# Altium project ALCT_MEZ_SPARTAN6.PrjPcb (part 2 of 5)

## Sheet Configuration_Logic.SchDoc: Configuration Logic
size A2; Organization: UCLA High Energy Physics; DocumentNumber: 4; Revision: 2.0; SheetNumber: 4; SheetTotal: 12; CurrentDate: 8/7/2018; ModifiedDate: 8/20/2018
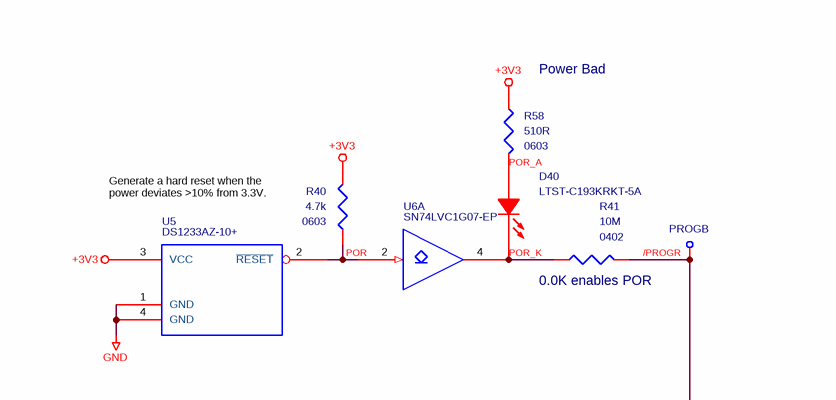
[diagram p5: Configuration_Logic.SchDoc, top left]
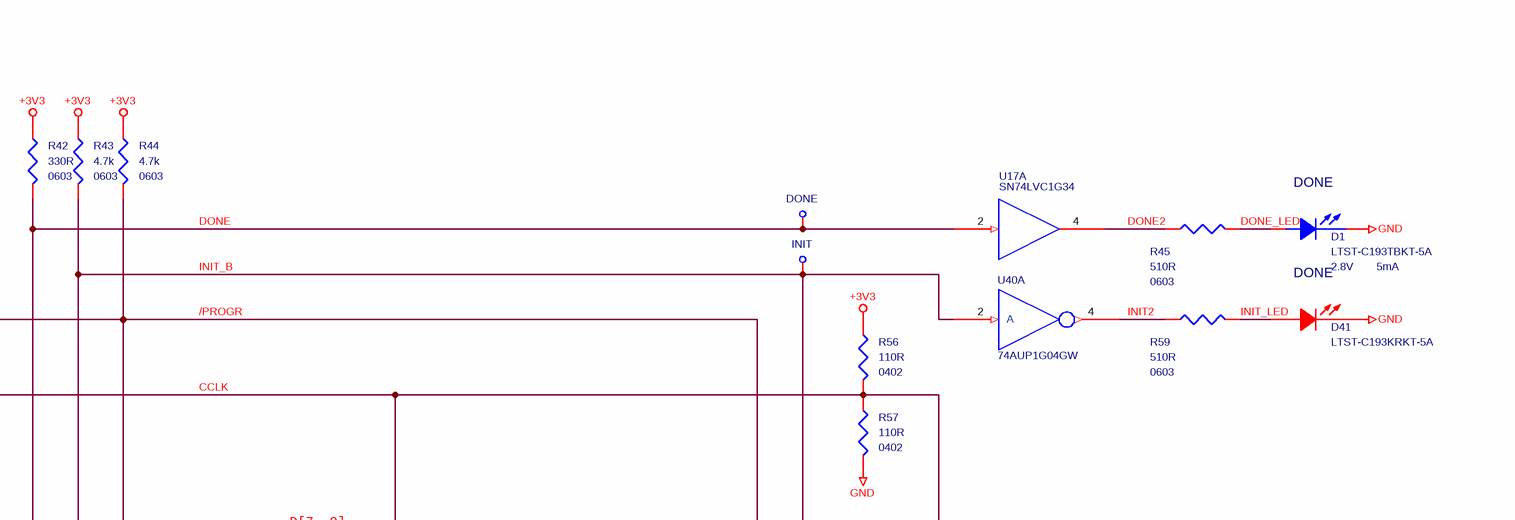
[diagram p6: Configuration_Logic.SchDoc, top right]
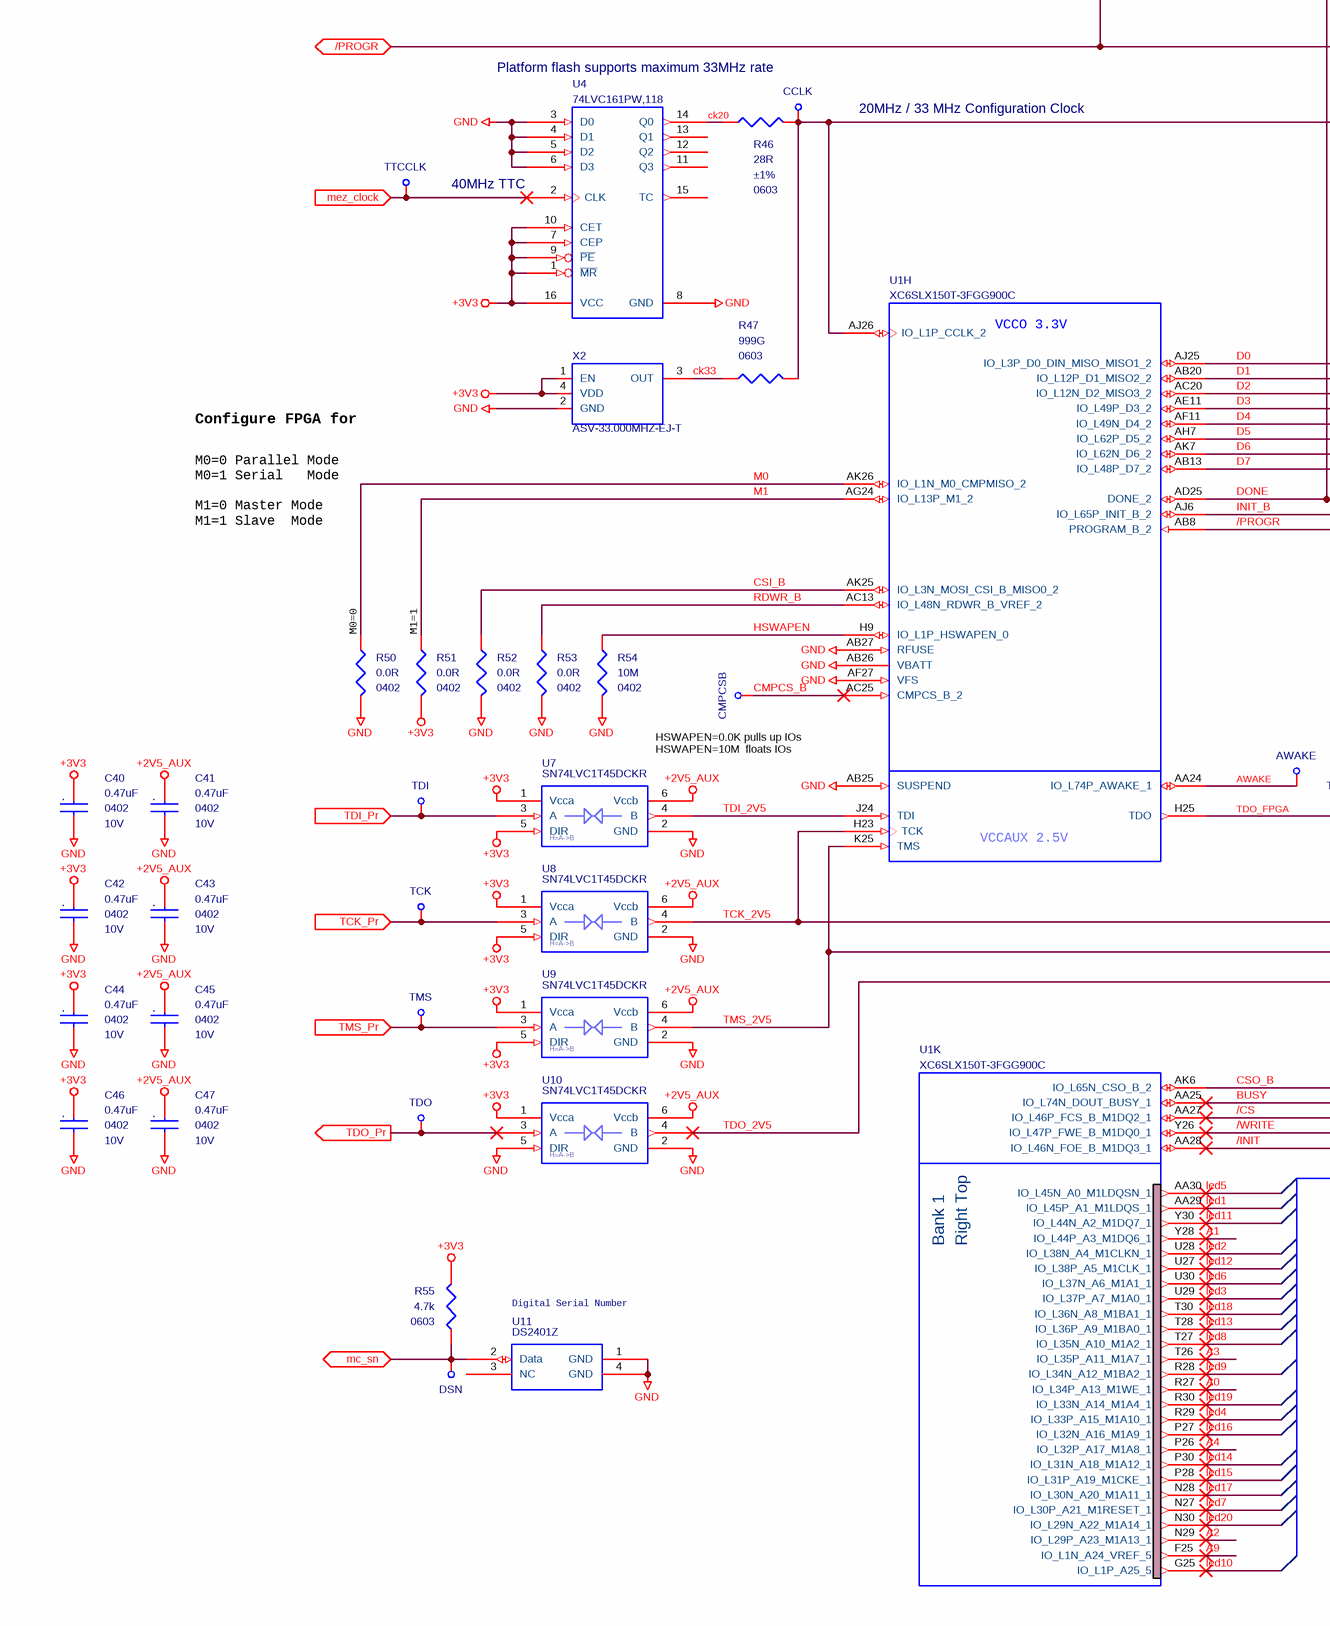
[diagram p7: Configuration_Logic.SchDoc, bottom left]
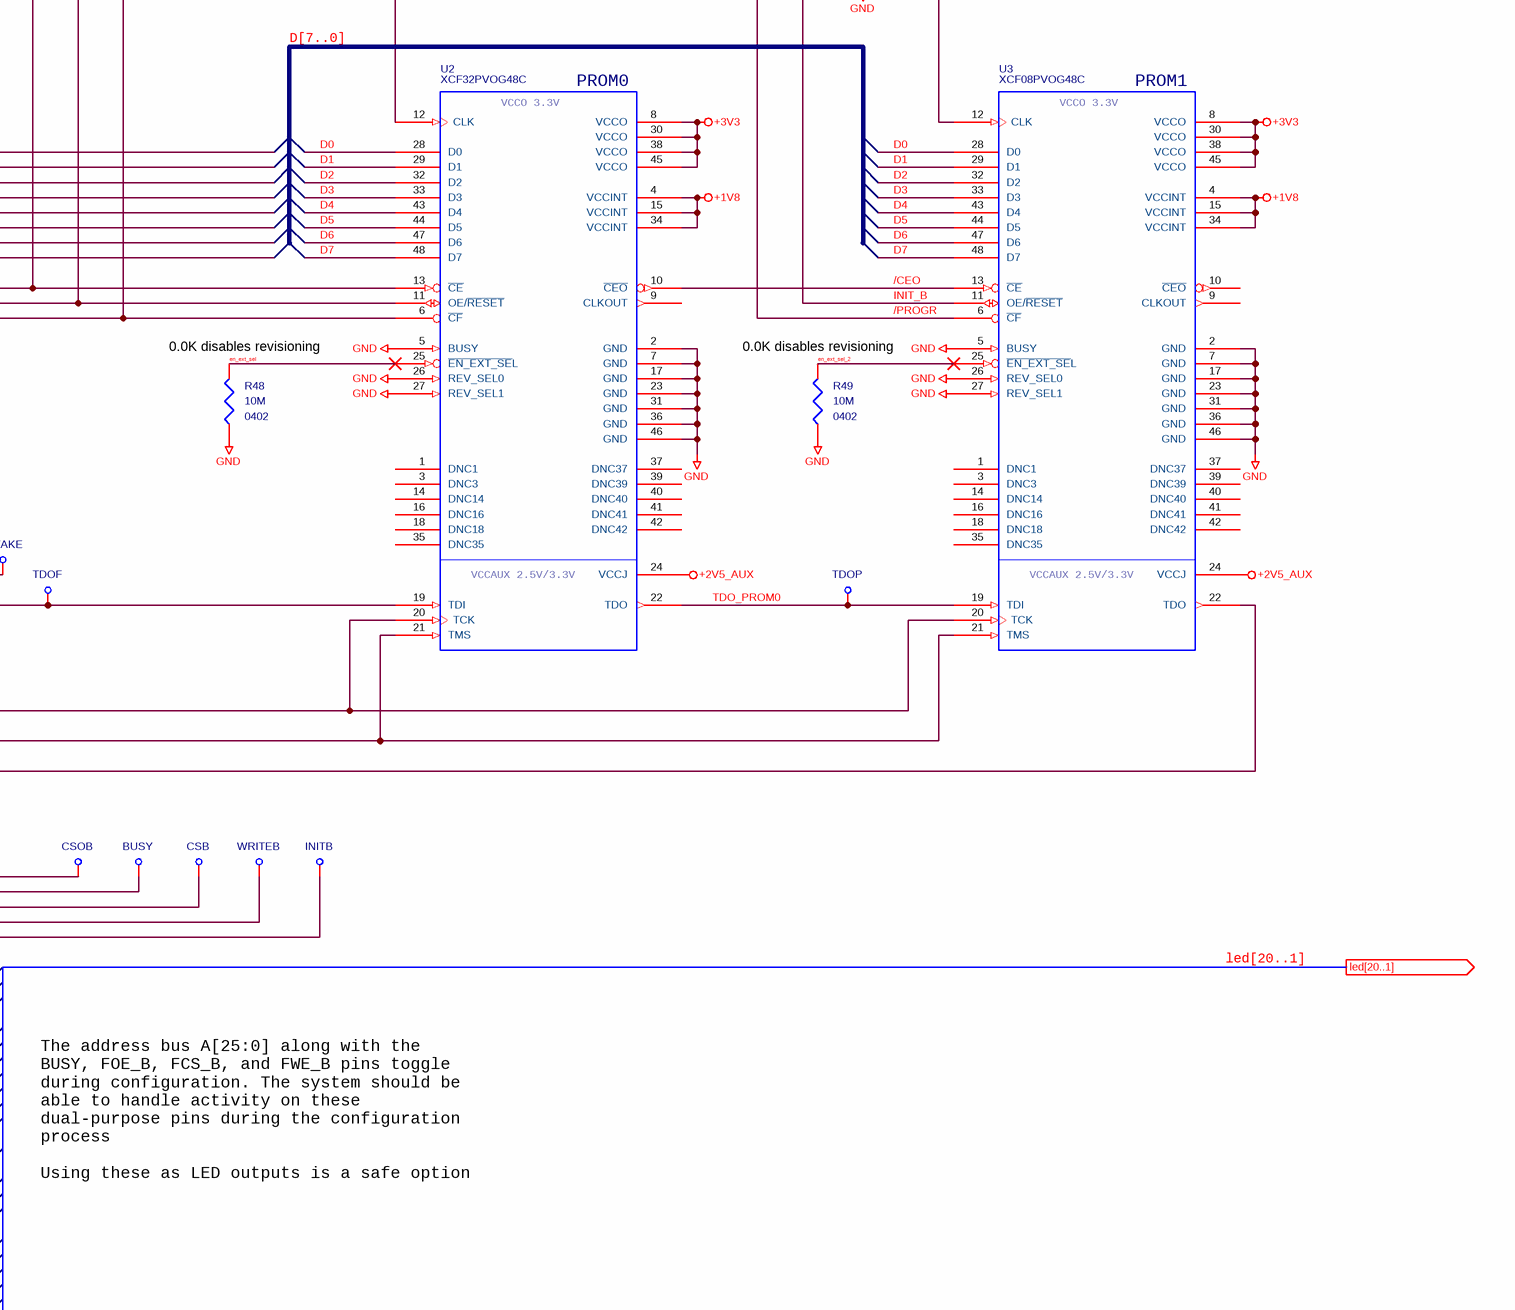
[diagram p8: Configuration_Logic.SchDoc, bottom right]

### Parts
AWAKE  Test Point Via  [MC_S6/TH/TPVIA]  (value not drawn)  (no BOM)
BUSY  Test Point Via  [MC_S6/TH/TPVIA]  (value not drawn)  (no BOM)
C40  0.47uF  Voltage - Rated: 10V  package: 0402  [MC_S6/SM/C_0402_IPC]
C41  0.47uF  Voltage - Rated: 10V  package: 0402  [MC_S6/SM/C_0402_IPC]
C42  0.47uF  Voltage - Rated: 10V  package: 0402  [MC_S6/SM/C_0402_IPC]
C43  0.47uF  Voltage - Rated: 10V  package: 0402  [MC_S6/SM/C_0402_IPC]
C44  0.47uF  Voltage - Rated: 10V  package: 0402  [MC_S6/SM/C_0402_IPC]
C45  0.47uF  Voltage - Rated: 10V  package: 0402  [MC_S6/SM/C_0402_IPC]
C46  0.47uF  Voltage - Rated: 10V  package: 0402  [MC_S6/SM/C_0402_IPC]
C47  0.47uF  Voltage - Rated: 10V  package: 0402  [MC_S6/SM/C_0402_IPC]
CCLK  Test Point Via  [MC_S6/TH/TPVIA]  (value not drawn)  (no BOM)
CMPCSB  Test Point Via  [MC_S6/TH/TPVIA]  (value not drawn)  (no BOM)
CSB  Test Point Via  [MC_S6/TH/TPVIA]  (value not drawn)  (no BOM)
CSOB  Test Point Via  [MC_S6/TH/TPVIA]  (value not drawn)  (no BOM)
D1  LTST-C193TBKT-5A  Voltage - Forward (Vf) (Typ): 2.8V  Current - Test: 5mA  [MC_S6/SM/LED_0603]
D40  LTST-C193KRKT-5A  [MC_S6/SM/LED_0603]
D41  LTST-C193KRKT-5A  [MC_S6/SM/LED_0603]
DONE  Test Point Via  [MC_S6/TH/TPVIA]  (value not drawn)  (no BOM)
DSN  Test Point Via  [MC_S6/TH/TPVIA]  (value not drawn)  (no BOM)
INIT  Test Point Via  [MC_S6/TH/TPVIA]  (value not drawn)  (no BOM)
INITB  Test Point Via  [MC_S6/TH/TPVIA]  (value not drawn)  (no BOM)
PROGB  Test Point Via  [MC_S6/TH/TPVIA]  (value not drawn)  (no BOM)
R40  4.7k  Supplier Device Package: 0603  [MC_S6/SM/R_0603_IPC]
R41  10M  Supplier Device Package: 0402  [MC_S6/SM/C_0402_IPC]
R42  330R  Supplier Device Package: 0603  [MC_S6/SM/R_0603_IPC]
R43  4.7k  Supplier Device Package: 0603  [MC_S6/SM/R_0603_IPC]
R44  4.7k  Supplier Device Package: 0603  [MC_S6/SM/R_0603_IPC]
R45  510R  Supplier Device Package: 0603  [MC_S6/SM/R_0603_IPC]
R46  28R  Tolerance: ±1%  Supplier Device Package: 0603  [MC_S6/SM/R_0603_IPC]
R47  999G  Supplier Device Package: 0603  [MC_S6/SM/R_0603_IPC]  (no BOM)
R48  10M  Supplier Device Package: 0402  [MC_S6/SM/C_0402_IPC]
R49  10M  Supplier Device Package: 0402  [MC_S6/SM/C_0402_IPC]
R50  0.0R  Supplier Device Package: 0402  [MC_S6/SM/R_0402_IPC]
R51  0.0R  Supplier Device Package: 0402  [MC_S6/SM/R_0402_IPC]
R52  0.0R  Supplier Device Package: 0402  [MC_S6/SM/R_0402_IPC]
R53  0.0R  Supplier Device Package: 0402  [MC_S6/SM/R_0402_IPC]
R54  10M  Supplier Device Package: 0402  [MC_S6/SM/C_0402_IPC]
R55  4.7k  Supplier Device Package: 0603  [MC_S6/SM/R_0603_IPC]
R56  110R  Supplier Device Package: 0402  [MC_S6/SM/R_0402_IPC]
R57  110R  Supplier Device Package: 0402  [MC_S6/SM/R_0402_IPC]
R58  510R  Supplier Device Package: 0603  [MC_S6/SM/R_0603_IPC]
R59  510R  Supplier Device Package: 0603  [MC_S6/SM/R_0603_IPC]
TCK  Test Point Via  [MC_S6/TH/TPVIA]  (value not drawn)  (no BOM)
TDI  Test Point Via  [MC_S6/TH/TPVIA]  (value not drawn)  (no BOM)
TDO  Test Point Via  [MC_S6/TH/TPVIA]  (value not drawn)  (no BOM)
TDOF  Test Point Via  [MC_S6/TH/TPVIA]  (value not drawn)  (no BOM)
TDOP  Test Point Via  [MC_S6/TH/TPVIA]  (value not drawn)  (no BOM)
TMS  Test Point Via  [MC_S6/TH/TPVIA]  (value not drawn)  (no BOM)
TTCCLK  Test Point Via  [MC_S6/TH/TPVIA]  (value not drawn)  (no BOM)
U1  XC6SLX150T-3FGG900C  [MC_S6/BGA/FGG900]  (parts H,K of 13)
U2  XCF32PVOG48C  [MC_S6/SM/VOG48]
U3  XCF08PVOG48C  [MC_S6/SM/VOG48]
U4  74LVC161PW,118  [MC_S6/SM/TSSOP16]
U5  DS1233AZ-10+  [MC_S6/SM/SOT223_1243]
U6  SN74LVC1G07-EP  [SOT353-1]  (part A of 2)
U7  SN74LVC1T45DCKR  [MC_S6/SM/SOT_SC70_DCK6]
U8  SN74LVC1T45DCKR  [MC_S6/SM/SOT_SC70_DCK6]
U9  SN74LVC1T45DCKR  [MC_S6/SM/SOT_SC70_DCK6]
U10  SN74LVC1T45DCKR  [MC_S6/SM/SOT_SC70_DCK6]
U11  DS2401Z  [MC_S6/SM/SOT223_1243]
U17  SN74LVC1G34  [MC_S6/SM/SOT_553_DRL5]  (part A of 2)
U40  74AUP1G04GW  [SOT353-1]  (part A of 2)
WRITEB  Test Point Via  [MC_S6/TH/TPVIA]  (value not drawn)  (no BOM)
X2  ASV-33.000MHZ-EJ-T  [MC_S6/SM/XTAL-7x5.08]

### Ports
/PROGR (bidir), led[20..1] (out), mc_sn (bidir), mez_clock (in), TCK_Pr (in), TDI_Pr (in), TDO_Pr (out), TMS_Pr (in)

### Nets
+1V8: U2.4(VCCINT) U2.15(VCCINT) U2.34(VCCINT) U3.4(VCCINT) U3.15(VCCINT) U3.34(VCCINT)
+2V5_AUX: C41.1 C43.1 C45.1 C47.1 U2.24(VCCJ) U3.24(VCCJ) U7.6(Vccb) U8.6(Vccb) U9.6(Vccb) U10.6(Vccb)
+3V3: C40.1 C42.1 C44.1 C46.1 R40.1 R42.1 R43.1 R44.1 R51.2 R55.1 R56.1 R58.1 U2.8(VCCO) U2.30(VCCO) U2.38(VCCO) U2.45(VCCO) U3.8(VCCO) U3.30(VCCO) U3.38(VCCO) U3.45(VCCO) U4.1(~{MR}) U4.7(CEP) U4.9(~{PE}) U4.10(CET) U4.16(VCC) U5.3(VCC) U7.1(Vcca) U7.5(DIR) U8.1(Vcca) U8.5(DIR) U9.1(Vcca) U9.5(DIR) U10.1(Vcca) X2.1(EN) X2.4(VDD)
GND: C40.2 C41.2 C42.2 C43.2 C44.2 C45.2 C46.2 C47.2 D1.K(CATHODE) D41.K(CATHODE) R48.1 R49.1 R50.2 R52.2 R53.2 R54.2 R57.2 U1.AB25(SUSPEND) U1.AB26(VBATT) U1.AB27(RFUSE) U1.AF27(VFS) U2.2(GND) U2.5(BUSY) U2.7(GND) U2.17(GND) U2.23(GND) U2.26(REV_SEL0) U2.27(REV_SEL1) U2.31(GND) U2.36(GND) U2.46(GND) U3.2(GND) U3.5(BUSY) U3.7(GND) U3.17(GND) U3.23(GND) U3.26(REV_SEL0) U3.27(REV_SEL1) U3.31(GND) U3.36(GND) U3.46(GND) U4.3(D0) U4.4(D1) U4.5(D2) U4.6(D3) U4.8(GND) U5.1(GND) U5.4(GND) U7.2(GND) U8.2(GND) U9.2(GND) U10.2(GND) U10.5(DIR) U11.1(GND) U11.4(GND) X2.2(GND)
/CEO: U2.10(~{CEO}) U3.13(~{CE})
/CS: CSB.1(In) U1.AA27(IO_L46P_FCS_B_M1DQ2_1)
/INIT: INITB.1(In) U1.AA28(IO_L46N_FOE_B_M1DQ3_1)
/PROGR: PROGB.1(In) R41.2 R44.2 U1.AB8(PROGRAM_B_2) U2.6(~{CF}) U3.6(~{CF}) ; port /PROGR
/WRITE: U1.Y26(IO_L47P_FWE_B_M1DQ0_1) WRITEB.1(In)
A0: U1.R27(IO_L34P_A13_M1WE_1)
A1: U1.Y28(IO_L44P_A3_M1DQ6_1)
A2: U1.N29(IO_L29P_A23_M1A13_1)
A3: U1.T26(IO_L35P_A11_M1A7_1)
A4: U1.P26(IO_L32P_A17_M1A8_1)
A9: U1.F25(IO_L1N_A24_VREF_5)
AWAKE: AWAKE.1(In) U1.AA24(IO_L74P_AWAKE_1)
BUSY: BUSY.1(In) U1.AA25(IO_L74N_DOUT_BUSY_1)
CCLK: CCLK.1(In) R46.2 R47.2 R56.2 R57.1 U1.AJ26(IO_L1P_CCLK_2) U2.12(CLK) U3.12(CLK)
ck20: R46.1 U4.14(Q0)
ck33: R47.1 X2.3(OUT)
CMPCS_B: CMPCSB.1(In) U1.AC25(CMPCS_B_2)
CSI_B: R52.1 U1.AK25(IO_L3N_MOSI_CSI_B_MISO0_2)
CSO_B: CSOB.1(In) U1.AK6(IO_L65N_CSO_B_2)
D0: U1.AJ25(IO_L3P_D0_DIN_MISO_MISO1_2) U2.28(D0) U3.28(D0)
D1: U1.AB20(IO_L12P_D1_MISO2_2) U2.29(D1) U3.29(D1)
D2: U1.AC20(IO_L12N_D2_MISO3_2) U2.32(D2) U3.32(D2)
D3: U1.AE11(IO_L49P_D3_2) U2.33(D3) U3.33(D3)
D4: U1.AF11(IO_L49N_D4_2) U2.43(D4) U3.43(D4)
D5: U1.AH7(IO_L62P_D5_2) U2.44(D5) U3.44(D5)
D6: U1.AK7(IO_L62N_D6_2) U2.47(D6) U3.47(D6)
D7: U1.AB13(IO_L48P_D7_2) U2.48(D7) U3.48(D7)
DONE: DONE.1(In) R42.2 U1.AD25(DONE_2) U2.13(~{CE}) U17.2(A)
DONE2: R45.1 U17.4(Y)
DONE_LED: D1.A(ANODE) R45.2
en_ext_sel: R48.2 U2.25(~{EN_EXT_SE}L)
en_ext_sel_2: R49.2 U3.25(~{EN_EXT_SE}L)
HSWAPEN: R54.1 U1.H9(IO_L1P_HSWAPEN_0)
INIT2: R59.1 U40.4(Y)
INIT_B: INIT.1(In) R43.2 U1.AJ6(IO_L65P_INIT_B_2) U2.11(OE/~{RESET}) U3.11(OE/~{RESET}) U40.2(A)
INIT_LED: D41.A(ANODE) R59.2
led1: U1.AA29(IO_L45P_A1_M1LDQS_1)
led2: U1.U28(IO_L38N_A4_M1CLKN_1)
led3: U1.U29(IO_L37P_A7_M1A0_1)
led4: U1.R29(IO_L33P_A15_M1A10_1)
led5: U1.AA30(IO_L45N_A0_M1LDQSN_1)
led6: U1.U30(IO_L37N_A6_M1A1_1)
led7: U1.N27(IO_L30P_A21_M1RESET_1)
led8: U1.T27(IO_L35N_A10_M1A2_1)
led9: U1.R28(IO_L34N_A12_M1BA2_1)
led10: U1.G25(IO_L1P_A25_5)
led11: U1.Y30(IO_L44N_A2_M1DQ7_1)
led12: U1.U27(IO_L38P_A5_M1CLK_1)
led13: U1.T28(IO_L36P_A9_M1BA0_1)
led14: U1.P30(IO_L31N_A18_M1A12_1)
led15: U1.P28(IO_L31P_A19_M1CKE_1)
led16: U1.P27(IO_L32N_A16_M1A9_1)
led17: U1.N28(IO_L30N_A20_M1A11_1)
led18: U1.T30(IO_L36N_A8_M1BA1_1)
led19: U1.R30(IO_L33N_A14_M1A4_1)
led20: U1.N30(IO_L29N_A22_M1A14_1)
M0: R50.1 U1.AK26(IO_L1N_M0_CMPMISO_2)
M1: R51.1 U1.AG24(IO_L13P_M1_2)
mc_sn: DSN.1(In) R55.2 U11.2(Data) ; port mc_sn
mez_clock: TTCCLK.1(In) U4.2(CLK) ; port mez_clock
POR: R40.2 U5.2(~{RESET}) U6.2(A)
POR_A: D40.A(ANODE) R58.2
POR_K: D40.K(CATHODE) R41.1 U6.4(Y)
RDWR_B: R53.1 U1.AC13(IO_L48N_RDWR_B_VREF_2)
TCK_2V5: U1.H23(TCK) U2.20(TCK) U3.20(TCK) U8.4(B)
TCK_Pr: TCK.1(In) U8.3(A) ; port TCK_Pr
TDI_2V5: U1.J24(TDI) U7.4(B)
TDI_Pr: TDI.1(In) U7.3(A) ; port TDI_Pr
TDO_2V5: U3.22(TDO) U10.4(B)
TDO_FPGA: TDOF.1(In) U1.H25(TDO) U2.19(TDI)
TDO_Pr: TDO.1(In) U10.3(A) ; port TDO_Pr
TDO_PROM0: TDOP.1(In) U2.22(TDO) U3.19(TDI)
TMS_2V5: U1.K25(TMS) U2.21(TMS) U3.21(TMS) U9.4(B)
TMS_Pr: TMS.1(In) U9.3(A) ; port TMS_Pr

Not connected (* = marked no-connect by the designer): U2 1(DNC1) 3(DNC3) 9(CLKOUT) 14(DNC14) 16(DNC16) 18(DNC18) 35(DNC35) 37(DNC37) 39(DNC39) 40(DNC40) 41(DNC41) 42(DNC42); U3 1(DNC1) 3(DNC3) 9(CLKOUT) 10(~{CEO}) 14(DNC14) 16(DNC16) 18(DNC18) 35(DNC35) 37(DNC37) 39(DNC39) 40(DNC40) 41(DNC41) 42(DNC42); U4 11(Q3) 12(Q2) 13(Q1) 15(TC); U11 3(NC)

### Buses and harness runs
bus D[7..0]
bus led[20..1] = port led[20..1]

### Notes on the sheet
- (near R58) Power Bad
- Generate a hard reset when the power deviates >10% from 3.3V.
- (near R41) 0.0K enables POR
- (near D1) DONE
- DONE
- Platform flash supports maximum 33MHz rate
- 20MHz / 33 MHz Configuration Clock
- 40MHz TTC
- (near U2) PROM0
- (near U3) PROM1
- Configure FPGA for Parallel Slave SelectMap
- M0=0 Parallel Mode
  M0=1 Serial   Mode
  M1=0 Master Mode
  M1=1 Slave  Mode
- (near R48) 0.0K disables revisioning
- (near R49) 0.0K disables revisioning
- (near R50) M0=0
- (near R51) M1=1
- HSWAPEN=0.0K pulls up IOs
  HSWAPEN=10M  floats IOs
- Digital Serial Number
- The address bus A[25:0] along with the BUSY, FOE_B, FCS_B, and FWE_B pins toggle during configuration. The system should be able to handle activity on these dual-purpose pins during the configuration process
  Using these as LED outputs is a safe option
- Date:
- Rev:
- Sheet
- of
- (in symbol GRM155R61A474KE15J) .
- (in symbol SN74LVC1T45-EP-ALCT_1) H=A->B
- (in symbol XC6SLX150T-3FGG900C, part H) VCCO 3.3V; VCCAUX 2.5V
- (in symbol XC6SLX150T-3FGG900C, part K) Bank 1; Right Top
- (in symbol XCF08PVOG48C) VCCO 3.3V; VCCAUX 2.5V/3.3V
- (in symbol XCF32PVOG48C) VCCO 3.3V; VCCAUX 2.5V/3.3V

### Library data of the parts
AWAKE BUSY CCLK CMPCSB CSB CSOB DONE DSN INIT INITB PROGB TCK TDI TDO TDOF TDOP TMS TTCCLK WRITEB = TPVIA: COMPSIDE: TOP; COMPGROUP: 0; mfgr: Layout; COMPROT: 0; Package: 90; mfgr_id: TPVIA; mfgr_foot: TPVIA
C40-C47 = GRM155R61A474KE15J: CAP CER 0.47UF 10V X5R 0402; Manufacturer: Murata Electronics North America; Capacitance: 0.47µF; Tolerance: ±10%; Supplier 1: Digi-Key; Manufacturer Part Number: GRM155R61A474KE15J; RoHS: RoHS Compliant; Category: Capacitors; Stock 1: 35266; Pricing 1: 1=0.1, 10=0.074, 100=0.0329, 500=0.02348, 1000=0.01845, 2500=0.01678, 5000=0.01543 (USD); Packaging: Cut Tape (CT); Part Status: Active; Operating Temperature: -55°C ~ 85°C; Features: -; Ratings: -; Applications: General Purpose; Mounting Type: Surface Mount, MLCC; Package / Case: 0402 (1005 Metric); Size / Dimension: 0.039" L x 0.020" W (1.00mm x 0.50mm); Height - Seated (Max): -; Thickness (Max): 0.022" (0.55mm); Lead Spacing: -; ComponentLink1URL: http://www.murata.com/~/media/webrenewal/support/library/catalog/products/capacitor/mlcc/c02e.ashx; ComponentLink1Description: http://www.murata.com/~/media/webrenewal/support/library/catalog/products/capacitor/mlcc/c02e.ashx; Supplier 2: Digi-Key; Stock 2: 35286; Pricing 2: 1=0.1, 10=0.074, 100=0.0329, 500=0.02348, 1000=0.01845, 2500=0.01678, 5000=0.01543 (USD); Supplier Part Number 1: 490-6305-1-ND; Supplier Part Number 2: 490-6305-6-ND; Temperature Coefficient: X5R
D1 = LTST-C193TBKT-5A: LED BLUE CLEAR 0603 SMD; Manufacturer: Lite-On Inc.; Lens Color: Colorless; Millicandela Rating: 15mcd; Lens Style/Size: Rectangle with Flat Top, 1.15mm x 0.80mm; Viewing Angle: 130°; Wavelength - Dominant: 470nm; Wavelength - Peak: 468nm; Supplier 1: Digi-Key; Manufacturer Part Number: LTST-C193TBKT-5A; RoHS: RoHS Compliant; Category: Optoelectronics; Stock 1: 380419; Pricing 1: 1=0.47, 10=0.336, 25=0.2572, 100=0.1678, 250=0.12304, 500=0.10442, 1000=0.08577 (USD); Packaging: Cut Tape (CT); Part Status: Active; Color: Blue; Lens Transparency: Clear; Mounting Type: Surface Mount; Features: -; Package / Case: 0603 (1608 Metric); Size / Dimension: 1.60mm L x 0.80mm W; Height (Max): 0.35mm; ComponentLink1URL: http://optoelectronics.liteon.com/upload/download/DS22-2004-060/P_100_LTST-C193TBKT-5A.pdf; ComponentLink1Description: http://optoelectronics.liteon.com/upload/download/DS22-2004-060/P_100_LTST-C193TBKT-5A.pdf; Supplier 2: Digi-Key; Stock 2: 380419; Pricing 2: 1=0.47, 10=0.336, 25=0.2572, 100=0.1678, 250=0.12304, 500=0.10442, 1000=0.08577 (USD); Supplier Part Number 1: 160-1827-1-ND; Supplier Part Number 2: 160-1827-6-ND; Supplier Device Package: Chip LED; ComponentLink2URL: http://media.digikey.com/pdf/Data%20Sheets/Lite-On%20PDFs/LTST-C193TBKT-5A.pdf; ComponentLink2Description: http://media.digikey.com/pdf/Data%20Sheets/Lite-On%20PDFs/LTST-C193TBKT-5A.pdf
D40 D41 = LTST-C193KRKT-5A: LED RED CLEAR 0603 SMD; Manufacturer: Lite-On Inc.; Lens Color: Colorless; Millicandela Rating: 26.05mcd; Lens Style/Size: Rectangle with Flat Top, 1.15mm x 0.80mm; Voltage - Forward (Vf) (Typ): 2V; Current - Test: 5mA; Viewing Angle: 130°; Wavelength - Dominant: 631nm; Wavelength - Peak: 639nm; Supplier 1: Digi-Key; Manufacturer Part Number: LTST-C193KRKT-5A; RoHS: RoHS Compliant; Category: Optoelectronics; Stock 1: 97257; Pricing 1: 1=0.41, 10=0.296, 25=0.2268, 100=0.148, 250=0.10852, 500=0.0921, 1000=0.07565, 2500=0.06578 (USD); Packaging: Cut Tape (CT); Part Status: Active; Color: Red; Lens Transparency: Clear; Mounting Type: Surface Mount; Features: -; Package / Case: 0603 (1608 Metric); Supplier Device Package: Chip LED; Size / Dimension: 1.60mm L x 0.80mm W; Height (Max): 0.45mm; ComponentLink1URL: http://optoelectronics.liteon.com/upload/download/DS22-2005-077/LTST-C193KRKT-5A.PDF; ComponentLink1Description: http://optoelectronics.liteon.com/upload/download/DS22-2005-077/LTST-C193KRKT-5A.PDF; Supplier 2: Digi-Key; Stock 2: 97257; Pricing 2: 1=0.41, 10=0.296, 25=0.2268, 100=0.148, 250=0.10852, 500=0.0921, 1000=0.07565, 2500=0.06578 (USD); Supplier Part Number 1: 160-1830-1-ND; Supplier Part Number 2: 160-1830-6-ND
R40 R43 R44 R55 = CR0603-FX-4701ELF: RES SMD 4.7K OHM 1% 1/10W 0603; Manufacturer: Bourns Inc.; Power (Watts): 0.1W, 1/10W; Temperature Coefficient: ±100ppm/°C; Supplier 1: Digi-Key; Manufacturer Part Number: CR0603-FX-4701ELF; RoHS: RoHS Compliant; Category: Resistors; Stock 1: 43560; Pricing 1: 1=0.1, 10=0.021, 100=0.0086, 1000=0.00385, 2500=0.00334 (USD); Packaging: Cut Tape (CT); Part Status: Active; Resistance (Ohms): 4.7k; Composition: Thick Film; Features: Moisture Resistant; Operating Temperature: -55°C ~ 155°C; Package / Case: 0603 (1608 Metric); Size / Dimension: 0.063" L x 0.031" W (1.60mm x 0.80mm); Height - Seated (Max): 0.022" (0.55mm); Failure Rate: -; ComponentLink1URL: http://www.bourns.com/docs/Product-Datasheets/CHPREZTR.pdf; ComponentLink1Description: http://www.bourns.com/docs/Product-Datasheets/CHPREZTR.pdf; Supplier 2: Digi-Key; Stock 2: 43560; Pricing 2: 1=0.1, 10=0.021, 100=0.0086, 1000=0.00385, 2500=0.00334 (USD); Supplier Part Number 1: CR0603-FX-4701ELFCT-ND; Supplier Part Number 2: CR0603-FX-4701ELFDKR-ND; Tolerance: ±1%
R41 R48 R49 R54 = ERJ-2GEJ106X: RES SMD 10M OHM 5% 1/10W 0402; Manufacturer: Panasonic Electronic Components; Power (Watts): 0.1W, 1/10W; Temperature Coefficient: -400/ +150ppm/°C; Tolerance: ±5%; Supplier 1: Digi-Key; Manufacturer Part Number: ERJ-2GEJ106X; RoHS: RoHS Compliant; Category: Resistors; Stock 1: 53777; Pricing 1: 1=0.1, 50=0.0106, 100=0.0078, 250=0.00596, 500=0.00476, 1000=0.0035, 5000=0.00251 (USD); Packaging: Cut Tape (CT); Part Status: Active; Resistance (Ohms): 10M; Composition: Thick Film; Features: Automotive AEC-Q200; Operating Temperature: -55°C ~ 155°C; Package / Case: 0402 (1005 Metric); Size / Dimension: 0.039" L x 0.020" W (1.00mm x 0.50mm); Height - Seated (Max): 0.016" (0.40mm); Number of Terminations: 2; Failure Rate: -; ComponentLink1URL: http://industrial.panasonic.com/www-cgi/jvcr13pz.cgi?E+PZ+3+AOA0001+ERJ2GEJ106X+7+WW; ComponentLink1Description: http://industrial.panasonic.com/www-cgi/jvcr13pz.cgi?E+PZ+3+AOA0001+ERJ2GEJ106X+7+WW; Supplier 2: Digi-Key; Stock 2: 53777; Pricing 2: 1=0.1, 50=0.0106, 100=0.0078, 250=0.00596, 500=0.00476, 1000=0.0035, 5000=0.00251 (USD); Supplier Part Number 1: P10MJCT-ND; Supplier Part Number 2: P10MJDKR-ND
R42 = CR0603-FX-3300ELF: RES SMD 330 OHM 1% 1/10W 0603; Manufacturer: Bourns Inc.; Resistance (Ohms): 330; Power (Watts): 0.1W, 1/10W; Temperature Coefficient: ±100ppm/°C; Tolerance: ±1%; Supplier 1: Digi-Key; Manufacturer Part Number: CR0603-FX-3300ELF; RoHS: RoHS Compliant; Category: Resistors; Stock 1: 45245; Pricing 1: 1=0.1, 10=0.023, 100=0.0092, 1000=0.00414, 2500=0.00359 (USD); Packaging: Cut Tape (CT); Part Status: Active; Composition: Thick Film; Features: Moisture Resistant; Operating Temperature: -55°C ~ 155°C; Package / Case: 0603 (1608 Metric); Size / Dimension: 0.063" L x 0.031" W (1.60mm x 0.80mm); Height - Seated (Max): 0.022" (0.55mm); Failure Rate: -; ComponentLink1URL: http://www.bourns.com/docs/Product-Datasheets/CHPREZTR.pdf; ComponentLink1Description: http://www.bourns.com/docs/Product-Datasheets/CHPREZTR.pdf; Supplier 2: Digi-Key; Stock 2: 45245; Pricing 2: 1=0.1, 10=0.023, 100=0.0092, 1000=0.00414, 2500=0.00359 (USD); Supplier Part Number 1: CR0603-FX-3300ELFCT-ND; Supplier Part Number 2: CR0603-FX-3300ELFDKR-ND
R45 R58 R59 = CR0603-FX-5100ELF: RES SMD 510 OHM 1% 1/10W 0603; Manufacturer: Bourns Inc.; Power (Watts): 0.1W, 1/10W; Temperature Coefficient: ±100ppm/°C; Tolerance: ±1%; Supplier 1: Digi-Key; Manufacturer Part Number: CR0603-FX-5100ELF; RoHS: RoHS Compliant; Category: Resistors; Stock 1: 523; Pricing 1: 1=0.1, 10=0.021, 100=0.0086, 1000=0.00385, 2500=0.00334 (USD); Packaging: Digi-Reel®; Part Status: Active; Composition: Thick Film; Features: Moisture Resistant; Operating Temperature: -55°C ~ 155°C; Package / Case: 0603 (1608 Metric); Size / Dimension: 0.063" L x 0.032" W (1.60mm x 0.80mm); Height - Seated (Max): 0.022" (0.55mm); Failure Rate: -; ComponentLink1URL: https://www.bourns.com/docs/Product-Datasheets/CHPREZTR.pdf; ComponentLink1Description: https://www.bourns.com/docs/Product-Datasheets/CHPREZTR.pdf; Supplier Part Number 1: CR0603-FX-5100ELFDKR-ND
R46 = ERJ-3EKF28R0V: RES SMD 28 OHM 1% 1/10W 0603; Manufacturer: Panasonic Electronic Components; Resistance (Ohms): 28; Power (Watts): 0.1W, 1/10W; Temperature Coefficient: ±100ppm/°C; Supplier 1: Digi-Key; Manufacturer Part Number: ERJ-3EKF28R0V; RoHS: RoHS Compliant; Category: Resistors; Stock 1: 22288; Pricing 1: 1=0.1, 10=0.019, 25=0.0136, 50=0.0104, 100=0.0077, 250=0.00584, 500=0.00468, 1000=0.00345 (USD); Packaging: Cut Tape (CT); Part Status: Active; Composition: Thick Film; Features: Automotive AEC-Q200; Operating Temperature: -55°C ~ 155°C; Package / Case: 0603 (1608 Metric); Size / Dimension: 0.063" L x 0.031" W (1.60mm x 0.80mm); Height - Seated (Max): 0.022" (0.55mm); Number of Terminations: 2; Failure Rate: -; ComponentLink1URL: http://industrial.panasonic.com/www-cgi/jvcr13pz.cgi?E+PZ+3+AOA0002+ERJ3EKF28R0V+7+WW; ComponentLink1Description: http://industrial.panasonic.com/www-cgi/jvcr13pz.cgi?E+PZ+3+AOA0002+ERJ3EKF28R0V+7+WW; Supplier 2: Digi-Key; Stock 2: 22288; Pricing 2: 1=0.1, 10=0.019, 25=0.0136, 50=0.0104, 100=0.0077, 250=0.00584, 500=0.00468, 1000=0.00345 (USD); Supplier Part Number 1: P28.0HCT-ND; Supplier Part Number 2: P28.0HDKR-ND
R47 = RES999G 0603: RES SMD 999G OHM 5% 1/10W 0603; Manufacturer Part Number: Do Not Place
R50-R53 = ERJ-2GE0R00X: RES SMD 0.0OHM JUMPER 1/10W 0402; Manufacturer: Panasonic Electronic Components; Resistance (Ohms): 0.0; Power (Watts): 0.1W, 1/10W; Tolerance: Jumper; Supplier 1: Digi-Key; Manufacturer Part Number: ERJ-2GE0R00X; RoHS: RoHS Compliant; Category: Resistors; Stock 1: 3132025; Pricing 1: 1=0.1, 50=0.0138, 100=0.0105, 250=0.0078, 500=0.00576, 1000=0.00384, 5000=0.0027 (USD); Packaging: Cut Tape (CT); Part Status: Active; Composition: Thick Film; Features: Automotive AEC-Q200; Temperature Coefficient: -; Operating Temperature: -55°C ~ 155°C; Package / Case: 0402 (1005 Metric); Size / Dimension: 0.039" L x 0.020" W (1.00mm x 0.50mm); Height - Seated (Max): 0.016" (0.40mm); Failure Rate: -; ComponentLink1URL: http://industrial.panasonic.com/www-cgi/jvcr13pz.cgi?E+PZ+3+AOA0001+ERJ2GE0R00X+7+WW; ComponentLink1Description: http://industrial.panasonic.com/www-cgi/jvcr13pz.cgi?E+PZ+3+AOA0001+ERJ2GE0R00X+7+WW; Supplier 2: Digi-Key; Stock 2: 3132025; Pricing 2: 1=0.1, 50=0.0138, 100=0.0105, 250=0.0078, 500=0.00576, 1000=0.00384, 5000=0.0027 (USD); Supplier Part Number 1: P0.0JCT-ND; Supplier Part Number 2: P0.0JDKR-ND; Number of Terminations: 2
R56 R57 = ERJ-2RKF1100X: RES SMD 110 OHM 1% 1/10W 0402; Manufacturer: Panasonic Electronic Components; Power (Watts): 0.1W, 1/10W; Temperature Coefficient: ±100ppm/°C; Supplier 1: Digi-Key; Manufacturer Part Number: ERJ-2RKF1100X; RoHS: RoHS Compliant; Category: Resistors; Stock 1: 171366; Pricing 1: 1=0.1, 10=0.039, 100=0.016, 1000=0.00719, 2500=0.00624, 5000=0.00515 (USD); Packaging: Cut Tape (CT); Part Status: Active; Composition: Thick Film; Features: Automotive AEC-Q200; Operating Temperature: -55°C ~ 155°C; Package / Case: 0402 (1005 Metric); Size / Dimension: 0.039" L x 0.020" W (1.00mm x 0.50mm); Height - Seated (Max): 0.016" (0.40mm); Failure Rate: -; ComponentLink1URL: https://industrial.panasonic.com/cdbs/www-data/pdf/RDA0000/AOA0000C304.pdf; ComponentLink1Description: https://industrial.panasonic.com/cdbs/www-data/pdf/RDA0000/AOA0000C304.pdf; Supplier 2: Digi-Key; Stock 2: 171366; Pricing 2: 1=0.1, 10=0.039, 100=0.016, 1000=0.00719, 2500=0.00624, 5000=0.00515 (USD); Supplier Part Number 1: P110LCT-ND; Supplier Part Number 2: P110LDKR-ND; Tolerance: ±1%
U1 = XC6SLX150T-3FGG900C: Spartan-6 LXT 1.2V FPGA, 540 User I/Os, 900-Ball Chip-Scale BGA (1.0mm Pitch), Speed Grade 3, Commercial Grade, Pb-Free; Manufacturer: Xilinx Inc.; Number of I/O: 540; Voltage - Supply: 1.14 V ~ 1.26 V; DatasheetVersion: ver1.6, Nov-2010; PackageVersion: ver1.4, Nov-2009; PackageReference: FGG900; PackageDescription: 900-Ball Fine-Pitch Ball Grid Array (FGG900) - Pb-Free; Code_JEDEC: MS-034-AAN-1; Code_IPC: BGA100P30X30-900; ComponentLink1Description: Manufacturer URL; ComponentLink1URL: http://www.xilinx.com/; ComponentLink2Description: Spartan-6 Datasheet; ComponentLink2URL: http://www.xilinx.com/support/documentation/data_sheets/ds160.pdf; ComponentLink3Description: Spartan-6 Documents; ComponentLink3URL: http://www.xilinx.com/support/documentation/spartan-6.htm; Supplier 1: Digi-Key; Manufacturer Part Number: XC6SLX150T-3FGG900C; RoHS: RoHS Compliant; Category: Integrated Circuits (ICs); Stock 1: 0; Pricing 1: 27=287.3 (USD); Part Status: Active; Mounting Type: Surface Mount; Operating Temperature: 0°C ~ 85°C (TJ); Package / Case: 900-BBGA; Supplier Device Package: 900-FBGA (31x31); ComponentLink4URL: http://www.xilinx.com/support/documentation/data_sheets/ds162.pdf; ComponentLink4Description: http://www.xilinx.com/support/documentation/data_sheets/ds162.pdf; Supplier Part Number 1: XC6SLX150T-3FGG900C-ND
U2 = XCF32PVOG48C: IC PROM SRL/PAR 1.8V 32M 48TSOP; Manufacturer: Xilinx Inc.; COMPSIDE: TOP; COMPGROUP: 0; COMPROT: 270; mfgr: Xilinx; mfgr_foot: VOG48; Programmable Type: In System Programmable; Memory Size: 32Mb; Voltage - Supply: 1.65 V ~ 2 V; mfgr_id: XCF32PVOG48C; Supplier 1: Digi-Key; Manufacturer Part Number: XCF32PVOG48C; RoHS: RoHS Compliant; Category: Integrated Circuits (ICs); Stock 1: 1063; Pricing 1: 1=27.23 (USD); Packaging: Tube; Part Status: Active; Operating Temperature: -40°C ~ 85°C; Package / Case: 48-TFSOP (0.724", 18.40mm Width); Supplier Device Package: 48-TSOP; ComponentLink1URL: http://www.xilinx.com/support/documentation/data_sheets/ds123.pdf; ComponentLink1Description: http://www.xilinx.com/support/documentation/data_sheets/ds123.pdf; Supplier Part Number 1: 122-1458-ND
U3 = XCF08PVOG48C: IC PROM SRL/PAR 1.8V 08M 48TSOP; Manufacturer: Xilinx Inc.; Programmable Type: In System Programmable; Memory Size: 8Mb; Voltage - Supply: 1.65 V ~ 2 V; Supplier 1: Digi-Key; Manufacturer Part Number: XCF08PVOG48C; RoHS: RoHS Compliant; Category: Integrated Circuits (ICs); Stock 1: 978; Pricing 1: 1=12.53 (USD); Packaging: Tube; Part Status: Active; Operating Temperature: -40°C ~ 85°C; Package / Case: 48-TFSOP (0.724", 18.40mm Width); Supplier Device Package: 48-TSOP; ComponentLink1URL: http://www.xilinx.com/support/documentation/data_sheets/ds123.pdf; ComponentLink1Description: http://www.xilinx.com/support/documentation/data_sheets/ds123.pdf; Supplier Part Number 1: 122-1454-ND
U4 = 74LVC161PW: IC SYNC 4BIT BIN COUNTER 16TSSOP; Manufacturer: NXP USA Inc.; Logic Type: Binary Counter; Direction: Up; Number of Elements: 1; Number of Bits per Element: 4; Reset: Asynchronous; Timing: Synchronous; Count Rate: 150MHz; Trigger Type: Positive Edge; Voltage - Supply: 1.2 V ~ 3.6 V; Supplier 1: Digi-Key; Manufacturer Part Number: 74LVC161PW,118; RoHS: RoHS Compliant; Category: Integrated Circuits (ICs); Stock 1: 3261; Pricing 1: 1=0.64, 10=0.561, 100=0.429, 500=0.3399, 1000=0.27225 (USD); Packaging: Cut Tape (CT); Part Status: Active; Operating Temperature: -40°C ~ 125°C; Mounting Type: Surface Mount; Package / Case: 16-TSSOP (0.173", 4.40mm Width); Supplier Device Package: 16-TSSOP; ComponentLink1URL: http://www.nxp.com/documents/data_sheet/74LVC161.pdf; ComponentLink1Description: http://www.nxp.com/documents/data_sheet/74LVC161.pdf; Supplier 2: Digi-Key; Stock 2: 3261; Pricing 2: 1=0.64, 10=0.561, 100=0.429, 500=0.3399, 1000=0.27225 (USD); Supplier Part Number 1: 568-7667-1-ND; Supplier Part Number 2: 568-7667-6-ND; Supplier 3: Digi-Key; Stock 3: 1164; Pricing 3: 1=0.64, 10=0.561, 100=0.43, 500=0.3399, 1000=0.27192 (USD); ComponentLink2URL: http://assets.nexperia.com/documents/data-sheet/74LVC161.pdf; ComponentLink2Description: http://assets.nexperia.com/documents/data-sheet/74LVC161.pdf; Supplier 4: Digi-Key; Stock 4: 1164; Pricing 4: 1=0.64, 10=0.561, 100=0.43, 500=0.3399, 1000=0.27192 (USD); Supplier Part Number 3: 1727-5981-1-ND; Supplier Part Number 4: 1727-5981-6-ND
U5 = DS1233AZ-10+: IC POR 2.88V 10% SOT223; Manufacturer: Maxim Integrated; Manufacturer Part Number: DS1233AZ-10+T&R; Output: Open Drain or Open Collector; Reset: Active Low; Reset Timeout: 250 ms Minimum; Supplier 1: Digi-Key; RoHS: RoHS Compliant; Category: Integrated Circuits (ICs); Stock 1: 3429; Pricing 1: 1=2.14, 10=2.015, 25=1.6116, 50=1.531, 100=1.4102, 250=1.33764, 500=1.28928 (USD); Packaging: Cut Tape (CT); Part Status: Active; Type: Simple Reset/Power-On Reset; Voltage - Threshold: 2.88V; Operating Temperature: -40°C ~ 85°C (TA); Mounting Type: Surface Mount; Package / Case: TO-261-4, TO-261AA; Supplier Device Package: SOT-223-3; ComponentLink1URL: http://datasheets.maximintegrated.com/en/ds/DS1233A.pdf; ComponentLink1Description: http://datasheets.maximintegrated.com/en/ds/DS1233A.pdf; Supplier 2: Digi-Key; Stock 2: 2849; Pricing 2: 1=2.55, 10=2.423, 25=1.7, 50=1.615, 100=1.26, 250=1.197 (USD); Supplier 3: Digi-Key; Stock 3: 3429; Pricing 3: 1=2.14, 10=2.015, 25=1.6116, 50=1.531, 100=1.4102, 250=1.33764, 500=1.28928 (USD); Supplier Part Number 1: DS1233AZ-10+CT-ND; Supplier Part Number 2: DS1233AZ-10+-ND; Supplier Part Number 3: DS1233AZ-10+DKR-ND
U6 = SN74LVC1G07-EP: IC BUFF/DVR NON-INVERT Open Drain SC70-5; Manufacturer: Texas Instruments; mfgr_id: SN74LVC1G07MDCKREP; mfgr: Texas Inst; mfgr_foot: DCK; COMPROT: 270; COMPGROUP: 0; COMPSIDE: TOP; Logic Type: Buffer, Non-Inverting; Number of Bits per Element: 1; Current - Output High, Low: -, 32mA; Voltage - Supply: 1.65 V ~ 5.5 V; Package: 99; Supplier 1: Digi-Key; Manufacturer Part Number: SN74LVC1G07MDCKREP; RoHS: RoHS Compliant; Category: Integrated Circuits (ICs); Stock 1: 4252; Pricing 1: 1=0.81, 10=0.714, 100=0.5472, 500=0.4326, 1000=0.34608 (USD); Packaging: Cut Tape (CT); Part Status: Active; Input Type: -; Output Type: Open Drain; Operating Temperature: -55°C ~ 125°C (TA); Mounting Type: Surface Mount; Package / Case: 5-TSSOP, SC-70-5, SOT-353; Supplier Device Package: SC-70-5; ComponentLink1URL: http://www.ti.com/lit/ds/symlink/sn74lvc1g07-ep.pdf; ComponentLink1Description: http://www.ti.com/lit/ds/symlink/sn74lvc1g07-ep.pdf; Supplier 2: Digi-Key; Stock 2: 4252; Pricing 2: 1=0.81, 10=0.714, 100=0.5472, 500=0.4326, 1000=0.34608 (USD); Supplier Part Number 1: 296-22343-1-ND; Supplier Part Number 2: 296-22343-6-ND
U7-U10 = SN74LVC1T45-EP-ALCT_1: IC BUS TRANSCVR TRI-ST SC70-6; Manufacturer: Texas Instruments; COMPSIDE: TOP; COMPGROUP: 0; COMPROT: 270; mfgr_id: SN74LVC1T45MDCKREP; mfgr: Texas Inst; mfgr_foot: DCK; Translator Type: Voltage Level; Channel Type: Bidirectional; Channels per Circuit: 1; Output Type: Tri-State, Non-Inverted; Data Rate: 420Mbps; Supplier 1: Digi-Key; Manufacturer Part Number: SN74LVC1T45DCKR; RoHS: RoHS Compliant; Category: Integrated Circuits (ICs); Stock 1: 91787; Pricing 1: 1=0.58, 10=0.494, 100=0.3692, 500=0.29004, 1000=0.22413 (USD); Packaging: Cut Tape (CT); Part Status: Active; Input Signal: -; Output Signal: -; Operating Temperature: -40°C ~ 85°C (TA); Features: -; Mounting Type: Surface Mount; Package / Case: 6-TSSOP, SC-88, SOT-363; Supplier Device Package: SC-70-6; ComponentLink1URL: http://www.ti.com/lit/ds/symlink/sn74lvc1t45.pdf; ComponentLink1Description: http://www.ti.com/lit/ds/symlink/sn74lvc1t45.pdf; Supplier 2: Digi-Key; Stock 2: 91787; Pricing 2: 1=0.58, 10=0.494, 100=0.3692, 500=0.29004, 1000=0.22413 (USD); Supplier Part Number 1: 296-16844-1-ND; Supplier Part Number 2: 296-16844-6-ND
U11 = DS2401_sot223: IC Digital Serial Number; Manufacturer: Maxim Integrated; Manufacturer Part Number: DS2401Z+T&R; Supplier 1: Digi-Key; RoHS: RoHS Compliant; Category: Integrated Circuits (ICs); Stock 1: 8136; Pricing 1: 1=2, 10=1.89, 25=1.51, 50=1.43, 100=1.32, 250=1.25, 500=1.21 (USD); Packaging: Cut Tape (CT); Part Status: Active; Type: Silicon Serial Number; Applications: PCB, Network Node, Equipment Identification/Registration; Mounting Type: Surface Mount; Package / Case: TO-261-4, TO-261AA; Supplier Device Package: SOT-223-3; ComponentLink1URL: http://pdfserv.maximintegrated.com/en/ds/DS2401.pdf; ComponentLink1Description: http://pdfserv.maximintegrated.com/en/ds/DS2401.pdf; Supplier 2: Digi-Key; Stock 2: 8136; Pricing 2: 1=2, 10=1.89, 25=1.51, 50=1.43, 100=1.32, 250=1.25, 500=1.21 (USD); Supplier Part Number 1: DS2401Z+T&RCT-ND; Supplier Part Number 2: DS2401Z+T&RDKR-ND
U17 = SN74LVC1G34DRLR: IC BUFFER NON-INVERT SOT5; Manufacturer: Texas Instruments; mfgr: Texas Inst; mfgr_foot: DRL; COMPROT: 270; COMPGROUP: 0; COMPSIDE: TOP; Logic Type: Buffer, Non-Inverting; Number of Bits per Element: 1; Output Type: Push-Pull; Current - Output High, Low: 32mA, 32mA; Voltage - Supply: 1.65 V ~ 5.5 V; Package: 99; mfgr_id: SN74LVC1G34DRLR; Supplier 1: Digi-Key; Manufacturer Part Number: SN74LVC1G34DRLR; RoHS: RoHS Compliant; Category: Integrated Circuits (ICs); Stock 1: 1633; Pricing 1: 1=0.48, 10=0.387, 100=0.2637, 500=0.19776, 1000=0.14832 (USD); Packaging: Cut Tape (CT); Part Status: Active; Input Type: -; Operating Temperature: -40°C ~ 125°C (TA); Mounting Type: Surface Mount; Package / Case: SOT-553; Supplier Device Package: SOT-5; ComponentLink1URL: http://www.ti.com/lit/ds/symlink/sn74lvc1g34.pdf; ComponentLink1Description: http://www.ti.com/lit/ds/symlink/sn74lvc1g34.pdf; Supplier 2: Digi-Key; Stock 2: 1633; Pricing 2: 1=0.48, 10=0.387, 100=0.2637, 500=0.19776, 1000=0.14832 (USD); Supplier Part Number 1: 296-18017-1-ND; Supplier Part Number 2: 296-18017-6-ND
U40 = 74AUP1G04GW: IC INVERTER LP 5TSSOP; Manufacturer: Nexperia USA Inc.; Manufacturer Part Number: 74AUP1G04GW,125; Number of Inputs: 1; Voltage - Supply: 0.8 V ~ 3.6 V; Current - Output High, Low: 4mA, 4mA; Logic Level - Low: 0.7 V ~ 0.9 V; Logic Level - High: 1.6 V ~ 2 V; Max Propagation Delay @ V, Max CL: 5.4ns @ 3.3V, 30pF; Supplier 1: Digi-Key; RoHS: RoHS Compliant; Category: Integrated Circuits (ICs); Stock 1: 16264; Pricing 1: 1=0.41, 10=0.311, 100=0.1938, 500=0.13258, 1000=0.10198 (USD); Packaging: Cut Tape (CT); Part Status: Active; Logic Type: Inverter; Features: -; Operating Temperature: -40°C ~ 125°C; Mounting Type: Surface Mount; Supplier Device Package: 5-TSSOP; Package / Case: 5-TSSOP, SC-70-5, SOT-353; ComponentLink1URL: http://assets.nexperia.com/documents/data-sheet/74AUP1G04.pdf; ComponentLink1Description: http://assets.nexperia.com/documents/data-sheet/74AUP1G04.pdf; Supplier 2: Digi-Key; Stock 2: 16264; Pricing 2: 1=0.41, 10=0.311, 100=0.1938, 500=0.13258, 1000=0.10198 (USD); Supplier Part Number 1: 1727-3176-1-ND; Supplier Part Number 2: 1727-3176-6-ND
X2 = ASV-33.000MHZ-EJ-T: XTAL, 33MHz, CMOS; Manufacturer: Abracon LLC; Function: Enable/Disable; Output: HCMOS; Voltage - Supply: 3.3V; Frequency Stability: ±20ppm; Current - Supply (Max): 20mA; Current - Supply (Disable) (Max): 10µA; Supplier 1: Digi-Key; Manufacturer Part Number: ASV-33.000MHZ-EJ-T; RoHS: RoHS Compliant; Category: Crystals, Oscillators, Resonators; Stock 1: 9939; Pricing 1: 1=1.73, 10=1.656, 50=1.617, 100=1.386, 500=1.3475 (USD); Packaging: Digi-Reel®; Part Status: Active; Type: XO (Standard); Frequency: 33MHz; Operating Temperature: -20°C ~ 70°C; Ratings: -; Mounting Type: Surface Mount; Size / Dimension: 0.276" L x 0.200" W (7.00mm x 5.08mm); Package / Case: 4-SMD, No Lead; ComponentLink1URL: http://www.abracon.com/Oscillators/ASV.pdf; ComponentLink1Description: http://www.abracon.com/Oscillators/ASV.pdf; Supplier Part Number 1: 535-9324-6-ND; Height - Seated (Max): 0.071" (1.80mm)

## Sheet Configuration_Power.SchDoc: Configuration Power
size A; Organization: UCLA High Energy Physics; DocumentNumber: 5; Revision: 2.0; SheetNumber: 5; SheetTotal: 12; CurrentDate: 8/7/2018; ModifiedDate: 8/20/2018
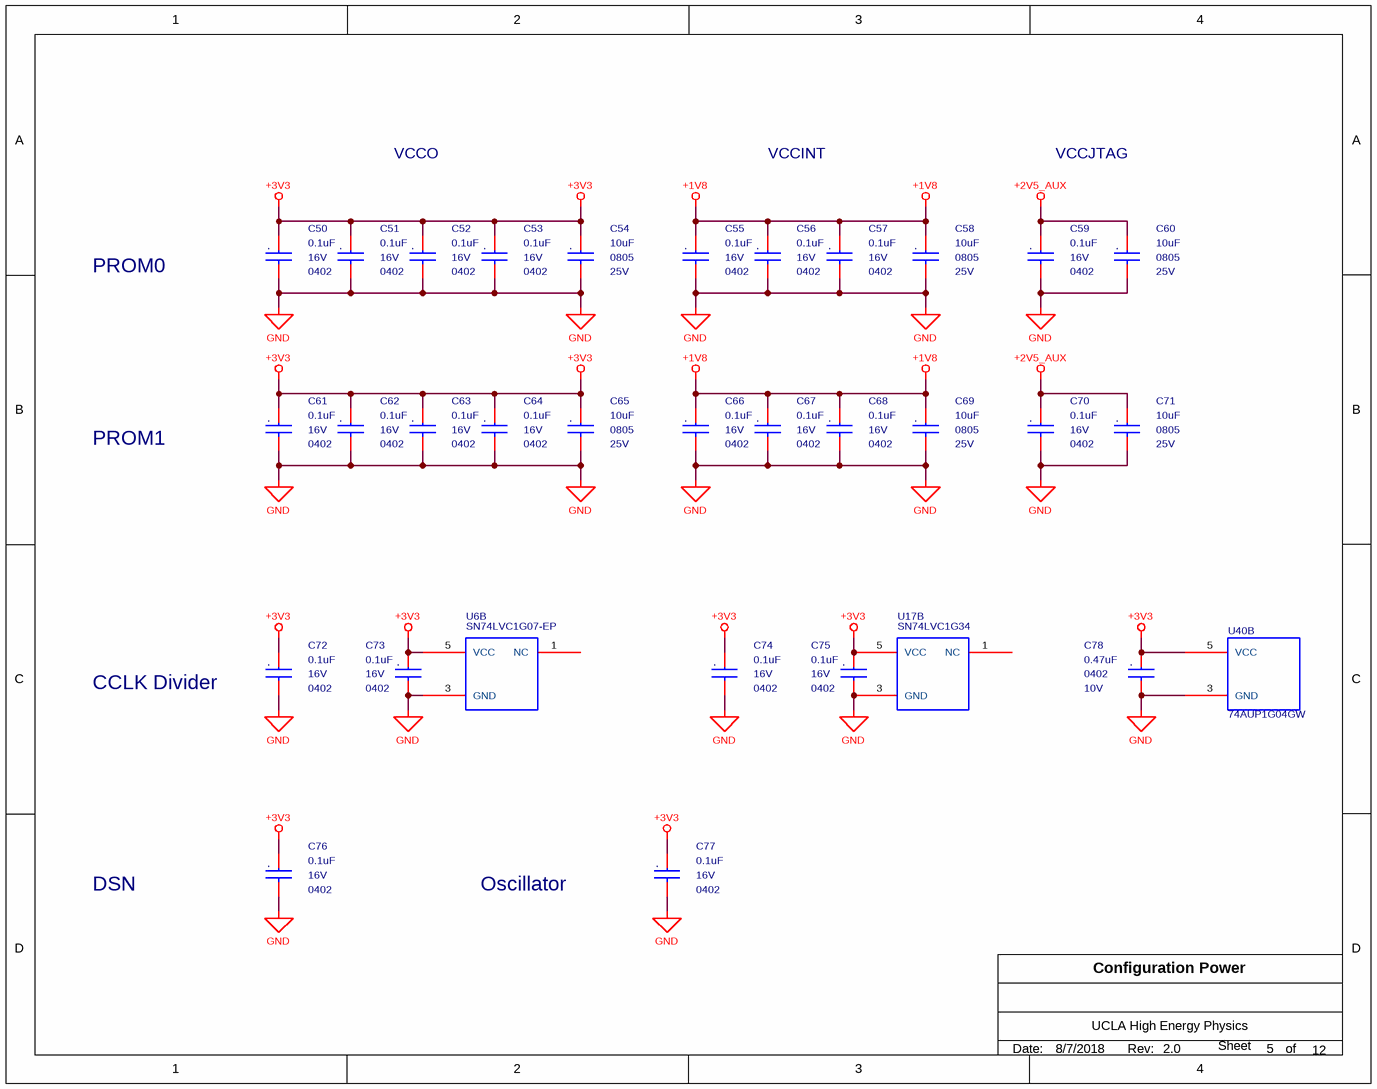
[diagram p9: Configuration_Power.SchDoc]

### Parts
C50  0.1uF  package: 0402  Voltage - Rated: 16V  [MC_S6/SM/C_0402_IPC]
C51  0.1uF  package: 0402  Voltage - Rated: 16V  [MC_S6/SM/C_0402_IPC]
C52  0.1uF  package: 0402  Voltage - Rated: 16V  [MC_S6/SM/C_0402_IPC]
C53  0.1uF  package: 0402  Voltage - Rated: 16V  [MC_S6/SM/C_0402_IPC]
C54  10uF  Voltage - Rated: 25V  package: 0805  [MC_S6/SM/C_0805_IPC]
C55  0.1uF  package: 0402  Voltage - Rated: 16V  [MC_S6/SM/C_0402_IPC]
C56  0.1uF  package: 0402  Voltage - Rated: 16V  [MC_S6/SM/C_0402_IPC]
C57  0.1uF  package: 0402  Voltage - Rated: 16V  [MC_S6/SM/C_0402_IPC]
C58  10uF  Voltage - Rated: 25V  package: 0805  [MC_S6/SM/C_0805_IPC]
C59  0.1uF  package: 0402  Voltage - Rated: 16V  [MC_S6/SM/C_0402_IPC]
C60  10uF  Voltage - Rated: 25V  package: 0805  [MC_S6/SM/C_0805_IPC]
C61  0.1uF  package: 0402  Voltage - Rated: 16V  [MC_S6/SM/C_0402_IPC]
C62  0.1uF  package: 0402  Voltage - Rated: 16V  [MC_S6/SM/C_0402_IPC]
C63  0.1uF  package: 0402  Voltage - Rated: 16V  [MC_S6/SM/C_0402_IPC]
C64  0.1uF  package: 0402  Voltage - Rated: 16V  [MC_S6/SM/C_0402_IPC]
C65  10uF  Voltage - Rated: 25V  package: 0805  [MC_S6/SM/C_0805_IPC]
C66  0.1uF  package: 0402  Voltage - Rated: 16V  [MC_S6/SM/C_0402_IPC]
C67  0.1uF  package: 0402  Voltage - Rated: 16V  [MC_S6/SM/C_0402_IPC]
C68  0.1uF  package: 0402  Voltage - Rated: 16V  [MC_S6/SM/C_0402_IPC]
C69  10uF  Voltage - Rated: 25V  package: 0805  [MC_S6/SM/C_0805_IPC]
C70  0.1uF  package: 0402  Voltage - Rated: 16V  [MC_S6/SM/C_0402_IPC]
C71  10uF  Voltage - Rated: 25V  package: 0805  [MC_S6/SM/C_0805_IPC]
C72  0.1uF  package: 0402  Voltage - Rated: 16V  [MC_S6/SM/C_0402_IPC]
C73  0.1uF  package: 0402  Voltage - Rated: 16V  [MC_S6/SM/C_0402_IPC]
C74  0.1uF  package: 0402  Voltage - Rated: 16V  [MC_S6/SM/C_0402_IPC]
C75  0.1uF  package: 0402  Voltage - Rated: 16V  [MC_S6/SM/C_0402_IPC]
C76  0.1uF  package: 0402  Voltage - Rated: 16V  [MC_S6/SM/C_0402_IPC]
C77  0.1uF  package: 0402  Voltage - Rated: 16V  [MC_S6/SM/C_0402_IPC]
C78  0.47uF  Voltage - Rated: 10V  package: 0402  [MC_S6/SM/C_0402_IPC]
U6  SN74LVC1G07-EP  [MC_S6/SM/SOT_SC70_DCK5]  (part B of 2)
U17  SN74LVC1G34  [MC_S6/SM/SOT_553_DRL5]  (part B of 2)
U40  74AUP1G04GW  [SOT353-1]  (part B of 2)

### Nets
+1V8: C55.1 C56.1 C57.1 C58.1 C66.1 C67.1 C68.1 C69.1
+2V5_AUX: C59.1 C60.1 C70.1 C71.1
+3V3: C50.1 C51.1 C52.1 C53.1 C54.1 C61.1 C62.1 C63.1 C64.1 C65.1 C72.1 C73.1 C74.1 C75.1 C76.1 C77.1 C78.1 U6.5(VCC) U17.5(VCC) U40.5(VCC)
GND: C50.2 C51.2 C52.2 C53.2 C54.2 C55.2 C56.2 C57.2 C58.2 C59.2 C60.2 C61.2 C62.2 C63.2 C64.2 C65.2 C66.2 C67.2 C68.2 C69.2 C70.2 C71.2 C72.2 C73.2 C74.2 C75.2 C76.2 C77.2 C78.2 U6.3(GND) U17.3(GND) U40.3(GND)

Not connected (* = marked no-connect by the designer): U6 1(NC); U17 1(NC)

### Notes on the sheet
- VCCO
- VCCINT
- VCCJTAG
- PROM0
- PROM1
- CCLK Divider
- DSN
- Oscillator
- Date:
- Rev:
- of
- Sheet
- (in symbol C0402C104K4RACTU) .
- (in symbol GRM21BR61E106KA73L) .
- (in symbol GRM155R61A474KE15J) .

### Library data of the parts
C50-C53 C55-C57 C59 C61-C64 C66-C68 C70 C72-C77 = C0402C104K4RACTU: CAP CER 0.1UF 16V X7R 0402; Manufacturer: KEMET; Capacitance: 0.10µF; Tolerance: ±10%; Supplier 1: Digi-Key; Manufacturer Part Number: C0402C104K4RACTU; RoHS: RoHS Compliant; Category: Capacitors; Stock 1: 3565698; Pricing 1: 1=0.11, 10=0.078, 25=0.0568, 50=0.0442, 100=0.0365, 250=0.03024, 500=0.02562, 1000=0.02121, 5000=0.01806 (USD); Packaging: Cut Tape (CT); Part Status: Active; Operating Temperature: -55°C ~ 125°C; Features: -; Ratings: -; Applications: General Purpose; Failure Rate: -; Mounting Type: Surface Mount, MLCC; Package / Case: 0402 (1005 Metric); Size / Dimension: 0.039" L x 0.020" W (1.00mm x 0.50mm); Height - Seated (Max): -; Thickness (Max): 0.022" (0.55mm); Lead Spacing: -; Lead Style: -; ComponentLink1URL: http://www.kemet.com/docfinder?Partnumber=C0402C104K4RACTU; ComponentLink1Description: http://www.kemet.com/docfinder?Partnumber=C0402C104K4RACTU; Supplier 2: Digi-Key; Stock 2: 3565998; Pricing 2: 1=0.11, 10=0.078, 25=0.0568, 50=0.0442, 100=0.0365, 250=0.03024, 500=0.02562, 1000=0.02121, 5000=0.01806 (USD); Supplier Part Number 1: 399-3521-1-ND; Supplier Part Number 2: 399-3521-6-ND; Temperature Coefficient: X7R
C54 C58 C60 C65 C69 C71 = GRM21BR61E106KA73L: CAP CER 10UF 25V X5R 0805; Manufacturer: Murata Electronics North America; Capacitance: 10µF; Tolerance: ±10%; Supplier 1: Digi-Key; Manufacturer Part Number: GRM21BR61E106KA73L; RoHS: RoHS Compliant; Category: Capacitors; Stock 1: 607428; Pricing 1: 1=0.19, 10=0.13, 50=0.0748, 100=0.0618, 250=0.052, 500=0.04356, 1000=0.03575 (USD); Packaging: Cut Tape (CT); Part Status: Active; Operating Temperature: -55°C ~ 85°C; Mounting Type: Surface Mount, MLCC; Size / Dimension: 0.079" L x 0.049" W (2.00mm x 1.25mm); Height - Seated (Max): -; Lead Spacing: -; Features: -; ComponentLink1URL: http://www.murata.com/~/media/webrenewal/support/library/catalog/products/capacitor/mlcc/c02e.pdf; ComponentLink1Description: http://www.murata.com/~/media/webrenewal/support/library/catalog/products/capacitor/mlcc/c02e.pdf; Supplier 2: Digi-Key; Supplier Part Number 1: 490-5523-1-ND; Supplier Part Number 2: 490-5523-6-ND; Package / Case: 0805 (2012 Metric); Temperature Coefficient: X5R; Ratings: -; Applications: General Purpose; Thickness (Max): 0.053" (1.35mm); Lead Style: -
C78 = GRM155R61A474KE15J: as C40 on sheet Configuration_Logic; Supplier 1: Digi-Key; Manufacturer Part Number: GRM155R61A474KE15J; RoHS: RoHS Compliant; Category: Capacitors; Stock 1: 35266; Pricing 1: 1=0.1, 10=0.074, 100=0.0329, 500=0.02348, 1000=0.01845, 2500=0.01678, 5000=0.01543 (USD); Packaging: Cut Tape (CT); Part Status: Active; Operating Temperature: -55°C ~ 85°C; Features: -; Ratings: -; Applications: General Purpose; Mounting Type: Surface Mount, MLCC; Package / Case: 0402 (1005 Metric); Size / Dimension: 0.039" L x 0.020" W (1.00mm x 0.50mm); Height - Seated (Max): -; Thickness (Max): 0.022" (0.55mm); Lead Spacing: -; ComponentLink1URL: http://www.murata.com/~/media/webrenewal/support/library/catalog/products/capacitor/mlcc/c02e.ashx; ComponentLink1Description: http://www.murata.com/~/media/webrenewal/support/library/catalog/products/capacitor/mlcc/c02e.ashx; Supplier 2: Digi-Key; Stock 2: 35286; Pricing 2: 1=0.1, 10=0.074, 100=0.0329, 500=0.02348, 1000=0.01845, 2500=0.01678, 5000=0.01543 (USD); Supplier Part Number 1: 490-6305-1-ND; Supplier Part Number 2: 490-6305-6-ND; Temperature Coefficient: X5R
U6 = SN74LVC1G07-EP: Manufacturer: Texas Instruments; mfgr_id: SN74LVC1G07MDCKREP; mfgr: Texas Inst; mfgr_foot: DCK; COMPROT: 270; COMPGROUP: 0; COMPSIDE: TOP; Logic Type: Buffer, Non-Inverting; Number of Bits per Element: 1; Output Type: Open Drain; Current - Output High, Low: -, 32mA; Voltage - Supply: 1.65 V ~ 5.5 V; Package: 99; Supplier 1: Digi-Key; Manufacturer Part Number: SN74LVC1G07MDCKREP; RoHS: RoHS Compliant; Category: Integrated Circuits (ICs); Stock 1: 4252; Pricing 1: 1=0.81, 10=0.714, 100=0.5472, 500=0.4326, 1000=0.34608 (USD); Packaging: Cut Tape (CT); Part Status: Active; Input Type: -; Operating Temperature: -55°C ~ 125°C (TA); Mounting Type: Surface Mount; Package / Case: 5-TSSOP, SC-70-5, SOT-353; Supplier Device Package: SC-70-5; ComponentLink1URL: http://www.ti.com/lit/ds/symlink/sn74lvc1g07-ep.pdf; ComponentLink1Description: http://www.ti.com/lit/ds/symlink/sn74lvc1g07-ep.pdf; Supplier 2: Digi-Key; Stock 2: 4252; Pricing 2: 1=0.81, 10=0.714, 100=0.5472, 500=0.4326, 1000=0.34608 (USD); Supplier Part Number 1: 296-22343-1-ND; Supplier Part Number 2: 296-22343-6-ND
U17 = SN74LVC1G34DRLR: as U17 on sheet Configuration_Logic; Package: 99; mfgr_id: SN74LVC1G34DRLR; Supplier 1: Digi-Key; Manufacturer Part Number: SN74LVC1G34DRLR; RoHS: RoHS Compliant; Category: Integrated Circuits (ICs); Stock 1: 1633; Pricing 1: 1=0.48, 10=0.387, 100=0.2637, 500=0.19776, 1000=0.14832 (USD); Packaging: Cut Tape (CT); Part Status: Active; Input Type: -; Operating Temperature: -40°C ~ 125°C (TA); Mounting Type: Surface Mount; Package / Case: SOT-553; Supplier Device Package: SOT-5; ComponentLink1URL: http://www.ti.com/lit/ds/symlink/sn74lvc1g34.pdf; ComponentLink1Description: http://www.ti.com/lit/ds/symlink/sn74lvc1g34.pdf; Supplier 2: Digi-Key; Stock 2: 1633; Pricing 2: 1=0.48, 10=0.387, 100=0.2637, 500=0.19776, 1000=0.14832 (USD); Supplier Part Number 1: 296-18017-1-ND; Supplier Part Number 2: 296-18017-6-ND
U40 = 74AUP1G04GW: as U40 on sheet Configuration_Logic; Supplier 1: Digi-Key; RoHS: RoHS Compliant; Category: Integrated Circuits (ICs); Stock 1: 16264; Pricing 1: 1=0.41, 10=0.311, 100=0.1938, 500=0.13258, 1000=0.10198 (USD); Packaging: Cut Tape (CT); Part Status: Active; Logic Type: Inverter; Features: -; Operating Temperature: -40°C ~ 125°C; Mounting Type: Surface Mount; Supplier Device Package: 5-TSSOP; Package / Case: 5-TSSOP, SC-70-5, SOT-353; ComponentLink1URL: http://assets.nexperia.com/documents/data-sheet/74AUP1G04.pdf; ComponentLink1Description: http://assets.nexperia.com/documents/data-sheet/74AUP1G04.pdf; Supplier 2: Digi-Key; Stock 2: 16264; Pricing 2: 1=0.41, 10=0.311, 100=0.1938, 500=0.13258, 1000=0.10198 (USD); Supplier Part Number 1: 1727-3176-1-ND; Supplier Part Number 2: 1727-3176-6-ND